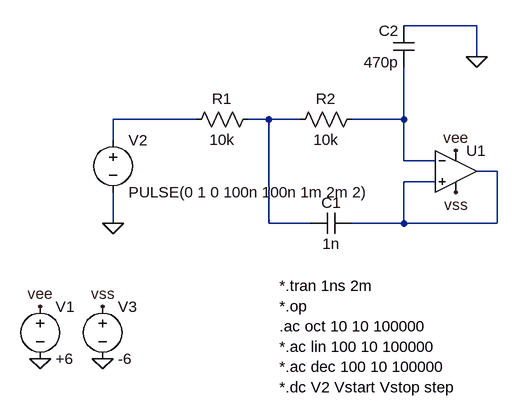
[diagram p0: schematic antialias-24kHz.asc]
antialias-24kHz.asc, the LTspice schematic file:
Version 4
SHEET 1 880 764
WIRE 432 48 320 48
WIRE 432 96 432 48
WIRE 0 192 -128 192
WIRE 112 192 80 192
WIRE 160 192 112 192
WIRE 320 192 320 112
WIRE 320 192 240 192
WIRE -128 224 -128 192
WIRE 320 256 320 192
WIRE 368 256 320 256
WIRE 464 272 432 272
WIRE 368 288 320 288
WIRE -128 352 -128 304
WIRE 112 352 112 192
WIRE 176 352 112 352
WIRE 320 352 320 288
WIRE 320 352 240 352
WIRE 464 352 464 272
WIRE 464 352 320 352
FLAG -128 352 0
FLAG 432 96 0
FLAG -240 480 vee
FLAG -144 480 vss
FLAG -144 560 0
FLAG -240 560 0
FLAG 400 240 vee
FLAG 400 304 vss
SYMBOL voltage -128 208 R0
SYMATTR InstName V2
SYMATTR Value PULSE(0 1 0 100n 100n 1m 2m 2)
SYMATTR Value2 AC 1 0
SYMBOL Res 96 176 R90
WINDOW 0 0 56 VBottom 2
WINDOW 3 32 56 VTop 2
SYMATTR InstName R1
SYMATTR Value 10k
SYMBOL Res 256 176 R90
WINDOW 0 0 56 VBottom 2
WINDOW 3 32 56 VTop 2
SYMATTR InstName R2
SYMATTR Value 10k
SYMBOL Cap 240 336 R90
WINDOW 0 0 32 VBottom 2
WINDOW 3 32 32 VTop 2
SYMATTR InstName C1
SYMATTR Value 1n
SYMBOL Cap 336 112 R180
WINDOW 0 24 56 Left 2
WINDOW 3 24 8 Left 2
SYMATTR InstName C2
SYMATTR Value 470p
SYMBOL OpAmps/UniversalOpAmp 400 272 R0
SYMATTR InstName U1
SYMBOL voltage -240 464 R0
SYMATTR InstName V1
SYMATTR Value +6
SYMATTR Value2 AC 0 0
SYMBOL voltage -144 464 R0
SYMATTR InstName V3
SYMATTR Value -6
SYMATTR Value2 AC 0 0
TEXT 128 448 Left 2 !*.tran 1ns 2m\n*.op\n.ac oct 10 10 100000\n*.ac lin 100 10 100000\n*.ac dec 100 10 100000\n*.dc V2 Vstart Vstop step

The netlist it stands for:
* antialias-24kHz.asc
V2 N001 0 PULSE(0 1 0 100n 100n 1m 2m 2) AC 1 0
R1 N002 N001 10k
R2 N003 N002 10k
C1 N004 N002 1n
C2 N003 0 470p
XU1 N004 N003 vee vss N004 level1 Avol=1Meg GBW=10Meg Vos=0 En=0 Enk=0 In=0 Ink=0 Rin=500Meg  ; pins In+ In- V+ V- OUT
V1 vee 0 +6 AC 0 0
V3 vss 0 -6 AC 0 0
*.tran 1ns 2m
*.op
.ac oct 10 10 100000
*.ac lin 100 10 100000
*.ac dec 100 10 100000
*.dc V2 Vstart Vstop step
.lib UniversalOpAmp1.lib
.backanno
.end